# EAGLE design Me-Bluetooth v2.0 (EAGLE 6.2)
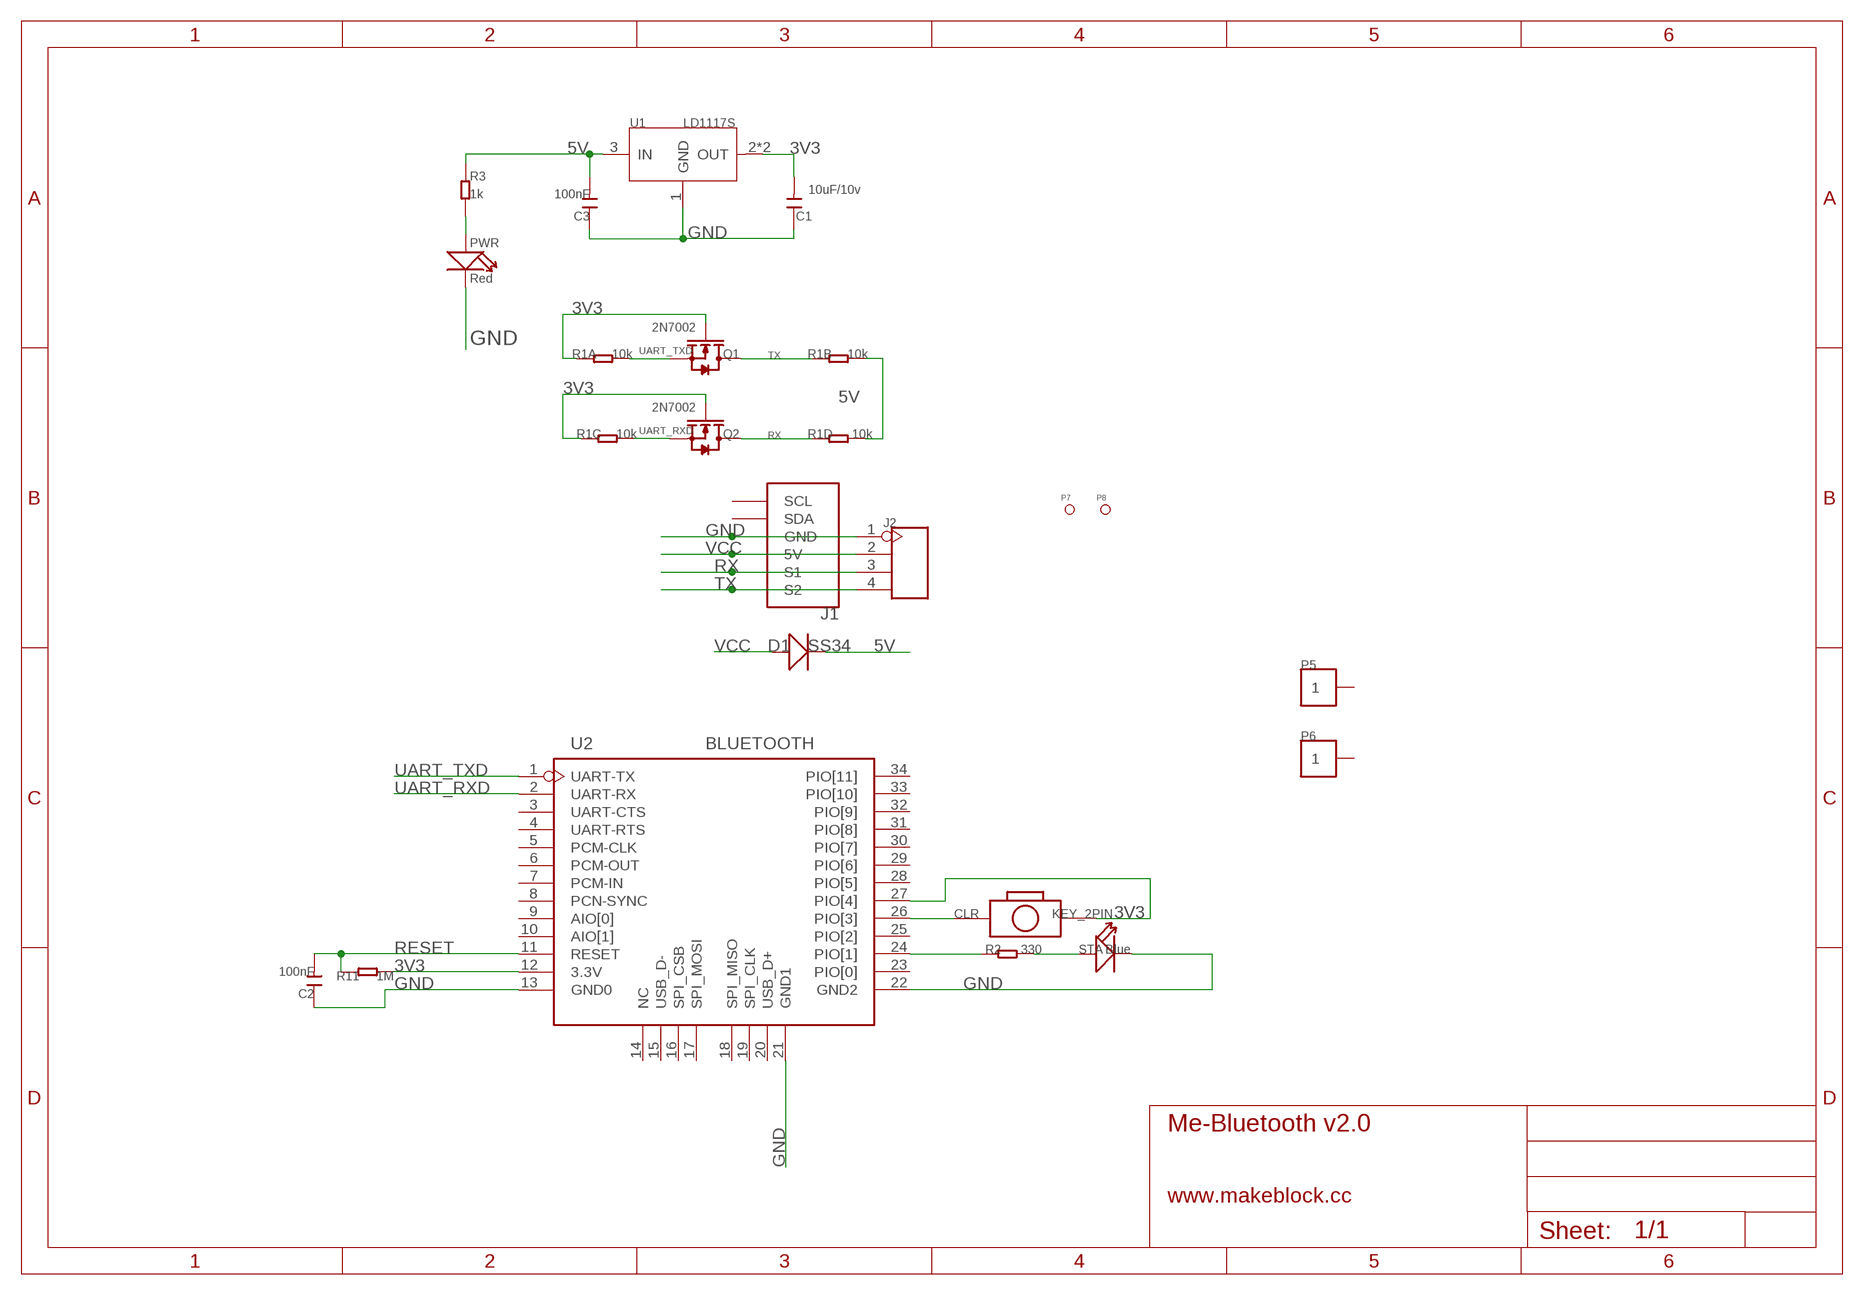
[diagram p0: schematic, sheet 1]

## Parts
C1  10uF/10v  C-0603  [0603]
C2  100nF  C-0603  [0603]
C3  100nF  C-0603  [0603]
CLR  KEY_2PIN  [KEY_2PIN]
D1  SS34  D'SMA'  [D2010]
J1  RJ11-6P6C-DIGI  [RJ11-6P6C]
J2  HEADER-4P-60/35MIL  [4P-65/35MIL]
P5  PAD-1P-4MM  [HOLE-01]
P6  PAD-1P-4MM  [HOLE-01]
P7  PAD-MARK  [ROUND-MARK-1.0]
P8  PAD-MARK  [ROUND-MARK-1.0]
PWR  Red  LED'0603'  [LED-0603]
Q1  2N7002  [2N7002]
Q2  2N7002  [2N7002]
R1  10k  R-4R-1206  [1206-8-3.3X2.4]
R2  330  R-0603  [0603]
R3  1k  R-0603  [0603]
R11  1M  R-0603  [0603]
STA  Blue  LED'0603'  [LED-0603]
U1  LD1117S  [SOT-223]
U2  BLUETOOTH  [BLUETOOTH]

## Nets
3V3: C1.2 CLR.P$2 Q1.1(G) Q2.1(G) R1.1 R1.3 R11.2 U1.2(OUT) U1.TER(OUT) U2.12(3.3V) U2.27(PIO[4])
5V [usbvcc]: C3.2 D1.- R1.5 R1.7 R3.1 U1.3(IN)
GND: C1.1 C2.1 C3.1 J1.3(GND) J2.1 PWR.- STA.- U1.1(GND) U2.13(GND0) U2.21(GND1) U2.22(GND2)
N$1: R2.2 STA.+
N$2: CLR.1 U2.26(PIO[3])
N$3: PWR.+ R3.2
N$6: R2.1 U2.24(PIO[1])
RESET: C2.2 R11.1 U2.11(RESET)
RX: J1.5(S1) J2.3 Q2.3(D) R1.4
TX: J1.6(S2) J2.4 Q1.3(D) R1.2
UART_RXD: Q2.2(S) R1.6 U2.2(UART-RX)
UART_TXD: Q1.2(S) R1.8 U2.1(UART-TX)
VCC [usbvcc]: D1.+ J1.4(5V) J2.2
Unconnected: J1.1(SCL) J1.2(SDA) P5.1 P6.1 U2.3(UART-CTS) U2.4(UART-RTS) U2.5(PCM-CLK) U2.6(PCM-OUT) U2.7(PCM-IN) U2.8(PCN-SYNC) U2.9(AIO[0]) U2.10(AIO[1]) U2.14(NC) U2.15(USB_D-) U2.16(SPI_CSB) U2.17(SPI_MOSI) U2.18(SPI_MISO) U2.19(SPI_CLK) U2.20(USB_D+) U2.23(PIO[0]) U2.25(PIO[2]) U2.28(PIO[5]) U2.29(PIO[6]) U2.30(PIO[7]) U2.31(PIO[8]) U2.32(PIO[9]) U2.33(PIO[10]) U2.34(PIO[11])

## Notes on the sheet
- www.makeblock.cc

## Library data of the parts
C1-C3 = Discrete:C*: Ceramic Capacitors
CLR = Makeblock:KEY_2PIN
D1 = Discrete:D*
J1 = Makeblock:RJ11-6P6C-DIGI
J2 = Connector:HEADER-4P
P5 P6 = Makeblock:PAD-1P*
P7 P8 = Discrete:PAD-MARK; PARTNO: DNP
PWR STA = Discrete:LED*
Q1 Q2 = Makeblock:2N7002
R1 = Discrete:R-4R*: Resistor Array
R2 R3 R11 = Discrete:R*
U1 = IC:LD1117: Low Drop Fixed And Adjustable Positive Voltage Regulators http://www.datasheetcatalog.org/datasheet/SGSThomsonMicroelectronics/mXuqtqv.pdf
U2 = Makeblock:BLUETOOTH

## Net classes
0 default: width 0.203 mm, drill 0.305 mm, clearance 0.152 mm
3 usbvcc: width 0.203 mm, drill 0.305 mm, clearance 0.203 mm

## Board
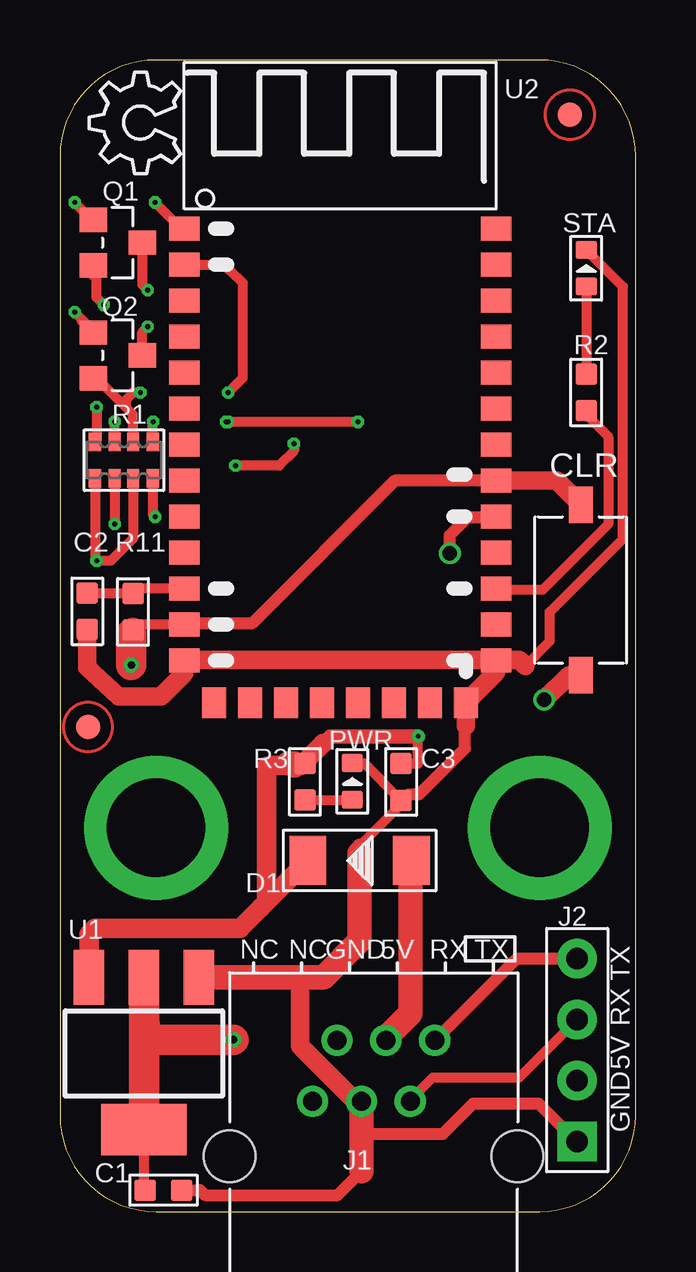
[diagram p1: board, top side]
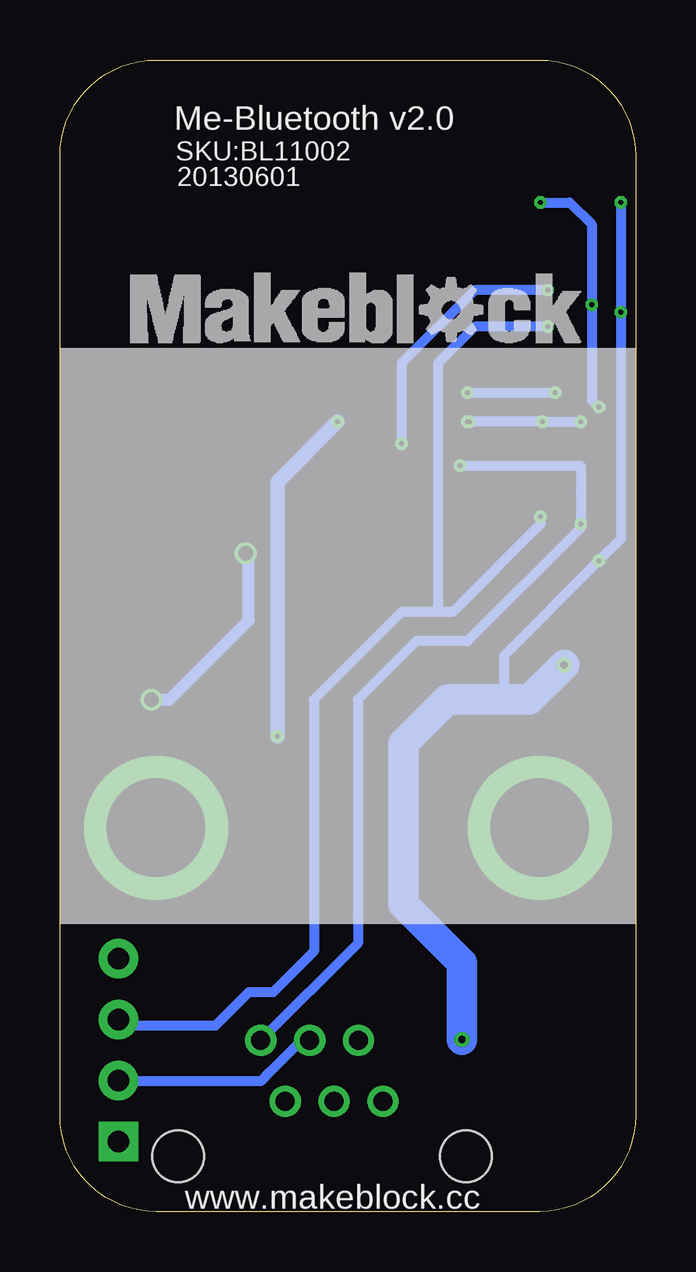
[diagram p2: board, bottom side, seen from below]

Size 24 x 48 mm. Coordinates in mm from the lower left corner, seen from the top.
Outline: 24,4 24,44 arc90 20,48 4,48 arc90 0,44 0,4 arc90 4,0 20,0 arc90 24,4
Copper layers (1*16): Top 0.035mm / dielectric 1.5mm / Bottom 0.035mm
Design rules: minimum track width 6mil, minimum drill 12mil, track to track 8mil, track to pad 8mil, pad to pad 8mil, via to via 8mil, smd to smd 0mil, copper to edge 10mil, drill to drill 10mil, minimum pad ring 10mil, minimum via ring 6mil, stop-mask expansion 2mil, vias tented up to drill 100mil, thermal gap 10mil

### Footprints (pad centres in the part's own frame; a part is rotated, then mirrored left to right if it is on the bottom)
0603 = smd 0.889 x 0.889: 1 -0.762,0; 2 0.762,0
KEY_2PIN = smd 1.524 x 1.016: 1 -3.556,0; P$2 3.556,0
D2010 = smd 1.524 x 2.032: + -2.159,0; - 2.159,0
RJ11-6P6C = drill 0.8: 1 -2.55,1.8; 2 -1.53,4.34; 3 -0.51,1.8; 4 0.51,4.34; 5 1.53,1.8; 6 2.55,4.34 | hole 2.15: -6,-0.5; 6,-0.5
4P-65/35MIL = drill 0.889 pad 1.651 square: 1 0,3.81 | drill 0.889 pad 1.651: 2 0,1.27; 3 0,-1.27; 4 0,-3.81
HOLE-01 = drill 4.1 pad 6: 1 0,0
ROUND-MARK-1.0 = smd 1.016 x 1.016: P$1 0,0
LED-0603 = smd 0.762 x 0.889: + -0.762,0; - 0.762,0
2N7002 = smd 1.016 x 1.143: 1 -0.95,-1.016; 2 0.95,-1.016; 3 0,1.016
1206-8-3.3X2.4 = smd 0.508 x 0.762: 1 -1.206,-0.762; 2 -0.381,-0.762; 3 0.381,-0.762; 4 1.206,-0.762; 5 1.206,0.762; 6 0.381,0.762; 7 -0.381,0.762; 8 -1.206,0.762
SOT-223 = smd 1.27 x 2.286: 1 -2.286,-3.175; 2 0,-3.175; 3 2.286,-3.175 | smd 3.556 x 2.159: TER 0,3.175
BLUETOOTH = smd 1.27 x 1: 1 -6.5,5.78; 2 -6.5,4.28; 3 -6.5,2.78; 4 -6.5,1.28; 5 -6.5,-0.22; 6 -6.5,-1.72; 7 -6.5,-3.22; 8 -6.5,-4.72; 9 -6.5,-6.22; 10 -6.5,-7.72; 11 -6.5,-9.22; 12 -6.5,-10.72; 13 -6.5,-12.22; 22 6.5,-12.22; 23 6.5,-10.72; 24 6.5,-9.22; 25 6.5,-7.72; 26 6.5,-6.22; 27 6.5,-4.72; 28 6.5,-3.22; 29 6.5,-1.72; 30 6.5,-0.22; 31 6.5,1.28; 32 6.5,2.78; 33 6.5,4.28; 34 6.5,5.78 | smd 1 x 1.27: 14 -5.25,-13.97; 15 -3.75,-13.97; 16 -2.25,-13.97; 17 -0.75,-13.97; 18 0.75,-13.97; 19 2.25,-13.97; 20 3.75,-13.97; 21 5.25,-13.97

### Placement (x,y rotation side)
C1  4.32,0.89 180 top
C2  1.14,25.02 90 top
C3  14.22,17.91 90 top
CLR  21.72,25.91 90 top
D1  12.5,14.63 180 top
J1  13.08,2.79 0 top
J2  21.57,6.73 180 top
P5  4,16 0 top
P6  20,16 0 top
P7  1.17,20.19 0 top
P8  21.26,45.72 0 top
PWR  12.19,17.93 90 top
Q1  2.41,40.39 270 top
Q2  2.41,35.69 270 top
R1  2.67,31.32 0 top
R2  21.95,34.14 90 top
R3  10.21,17.91 270 top
R11  3.05,24.99 270 top
STA  21.95,39.32 90 top
U1  3.5,6.59 180 top
U2  11.68,35.18 0 top
U$1  [LOGO-3/2]  21.08,36.2 0 bottom
U$2  [OSHW_6X150_NOTEXT]  5.04,43.26 90 top

### Tracks (layer width: path | path; a pad name or v marks a point on that pad's centre or on a via)
3V3  (via drill 0.2, 0.3 pad 0.61)
  Top 0.305: 2.82,24.23 2.97,24.08
  Top 0.406: R1.1 1.46,27.19 v1.52,27.13 2.13,27.13 3.05,28.04 R1.3 | 0.89,37.21 1.42,36.68 0.89,37.21 | 0.89,37.21 v0.61,37.49 | 1.42,41.25 1.4,41.27 | 1.4,41.27 v0.61,42.06 | 2.97,24.08 2.97,24.16 R11.2 3.27,24.46 U2.12 | C1.2 3.5,1.27 U1.TER | Q1.1 1.4,41.27 | 0.89,37.21 0.89,37.15 Q2.1
  Top 0.508: U2.27 13.95,30.46 8,24.51 5.24,24.51 U2.12
  Top 0.762: U2.27 20.72,30.46 CLR.P$2
  Top 1.016: 3.69,3.61 U1.TER | 3.05,24.25 R11.2
  Top 1.27: U1.TER U1.2 3.5,8 3.58,7.16 v7.24,7.16 | v2.97,22.78 2.97,24.08
  Bottom 0.406: v0.61,42.06 v0.61,37.49 0.61,28.04 v1.52,27.13 5.49,23.16 5.49,21.34
  Bottom 1.27: v7.24,7.16 7.24,10.36 9.68,12.8 9.68,19.51 7.85,21.34 5.49,21.34 4.42,21.34 v2.97,22.78
5V  (via drill 0.2)
  Top 0.406: R3.1 9.53,18.67 | 8.61,12.93 8.37,12.66 | R1.7 v2.29,32.92 | R1.5 3.87,32.91 v3.89,32.92 | v7.01,32.92 v12.42,32.92 | C3.2 14.94,18.67 v14.94,19.81
  Top 0.61: 10.97,19.51 11.28,19.81 v14.94,19.81
  Top 0.813: U1.3 1.22,11.58 1.45,11.81 7.52,11.81 8.37,12.66 D1.- | 10.97,19.51 10.06,18.59 9.78,18.59 8.79,18.59 8.61,18.54 8.61,12.93
  Top 1.016: 9.53,18.67 9.78,18.67 9.78,18.59
  Bottom 0.406: v2.29,32.92 v3.89,32.92 v6.93,32.92 v7.01,32.92
  Bottom 0.61: v14.94,19.81 14.94,30.4 v12.42,32.92
GND
  Top 0.406: 19.4,22.75 20.42,23.77 20.42,24.99 23.47,28.04 23.47,38.56 STA.- | C2.1 | 14.73,17.4 14.48,17.4 C3.1 | C3.1 14.22,16.97 12.5,15.24 | PWR.- 12.68,18.69 C3.1 | U2.13 5.18,22.43 5.18,22.88 5.08,22.99
  Top 0.508: 14.73,17.4 14.99,17.4 16.26,18.67 16.89,19.3 16.89,20.19 16.93,20.23 | U2.22 19.02,22.96 19.05,22.99 | C1.1 5.84,0.89 6.04,0.69 11.58,0.69 12.57,1.68 | J2.1 21.54,2.92 19.96,4.5 17.22,4.5 15.95,3.23 12.62,3.23 12.57,3.17
  Top 0.61: 12.5,14.94 12.5,15.24
  Top 0.762: C2.1 1.14,22.68 2.44,21.46 4.21,21.46 5.18,22.43 | 5.08,22.99 19.05,22.99 19.16,22.99 19.4,22.75 | U2.22 18.18,22.46 U2.21 16.93,20.23 | J1.3 12.32,4.59 10.01,6.91 10.01,9.54 9.78,9.77
  Top 1.016: U1.1 9.29,9.77 | 12.5,14.94 12.5,11.28 10.98,9.77 9.78,9.77 9.29,9.77 | 9.29,9.77 8.99,9.77 | J1.3 12.57,3.17 12.57,1.68
N$1
  Top 0.406: STA.+ R2.2
N$2  (via drill 0.6 pad 0.61)
  Top 0.508: v16.26,27.43 16.26,28.19 17.02,28.96 U2.26
  Top 0.762: CLR.1 21.21,22.35 v20.19,21.34
  Bottom 0.508: v20.19,21.34 19.43,21.34 16.13,24.64 16.13,27.3 v16.26,27.43
N$3
  Top 0.406: R3.2 12.17,17.15 PWR.+
N$6
  Top 0.406: R2.1 21.95,33.22 22.86,32.31 22.86,28.65 20.12,25.91 18.66,25.91
  Top 0.508: U2.24 18.61,25.96 18.66,25.91
RESET
  Top 0.406: 3.1,25.75 R11.1 | R11.1 1.14,25.76 C2.2 | U2.11 3.25,25.96 R11.1
RX  (via drill 0.2)
  Top 0.406: R1.4 3.87,29.04 v3.96,28.96 | 3.45,36.68 v3.66,36.88 3.43,36.65 Q2.3 | 14.63,4.64 14.63,4.67 15.54,5.59 19.15,5.59 J2.3
  Top 0.508: J1.5 14.63,4.64
  Bottom 0.406: v3.96,28.96 3.96,28.65 7.62,24.99 8.23,24.99 | 8.23,24.99 9.75,24.99 13.41,21.34 13.41,10.88 13.41,10.85 15.11,9.14 16.13,9.14 17.53,7.75 21.31,7.75 J2.3 | v3.66,36.88 6.71,36.88 8.23,35.36 8.23,24.99
TX  (via drill 0.2)
  Top 0.406: R1.2 2.29,29.26 v2.29,28.65 | 3.45,38.61 v3.66,38.41 3.43,38.63 Q1.3 | v9.75,32 9.75,31.7 9.14,31.09 v7.32,31.09
  Top 0.508: J2.4 19.04,10.54 J1.6
  Bottom 0.406: v2.29,28.65 2.29,28.5 7.01,23.77 9.14,23.77 11.58,21.34 11.58,12.19 11.58,11.18 J1.6 | v3.66,38.41 6.71,38.41 9.75,35.36 v9.75,32 | 2.29,29.87 v2.29,28.65 | v7.32,31.09 2.29,31.09 v2.29,28.65
UART_RXD  (via drill 0.2)
  Top 0.406: 1.56,34.71 2.64,33.63 | 2.64,33.63 2.74,33.53 | R1.6 3.05,33.22 2.74,33.53 | v7.01,34.14 7.62,34.75 7.62,38.71 7.08,39.25 6.87,39.46 U2.2 | v3.35,34.14 3.05,34.14 2.74,33.83 2.74,33.53 | Q2.2 1.53,34.74 2.64,33.63
  Bottom 0.406: v7.01,34.14 v3.35,34.14
UART_TXD  (via drill 0.2)
  Top 0.406: 5.28,40.75 4.85,41.17 | 4.85,41.17 v3.96,42.06 | v1.83,37.8 1.52,38.1 1.52,38.88 1.4,39 Q1.2 | v1.52,33.53 1.52,32.14 R1.8 | U2.1 5.07,40.96 4.85,41.17
  Bottom 0.406: v3.96,42.06 2.74,42.06 1.83,41.15 v1.83,37.8 1.83,33.83 v1.52,33.53
VCC
  Top 1.016: J1.4 13.59,7.24 14.61,8.26 14.61,14.58 D1.+
  Bottom 0.406: J1.4 13.92,7.13 15.24,5.82 15.62,5.44 21.54,5.44 J2.2

### Text on the board
tPlace: NC | NC | GND | 5V | RX | TX | TX | RX | 5V | GND
bPlace: Me-Bluetooth v2.0 | SKU:BL11002 | 20130601 | www.makeblock.cc